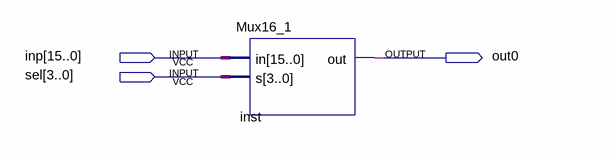
[diagram p0: schematic sheet]
// Quartus schematic MuxDemo2.bdf as structural Verilog: 1 symbols, 3 pins
module MuxDemo2 (
  input  [15:0] inp,
  input  [3:0] sel,
  output out0
);

  Mux16_1 inst (.in(inp), .s(sel), .out(out0));
endmodule
